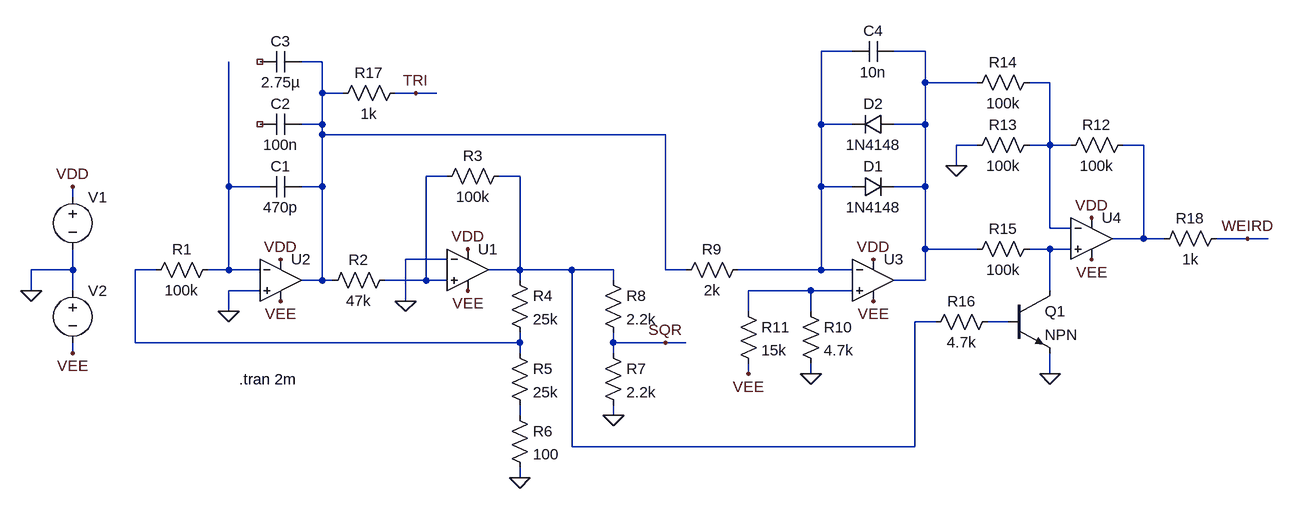
[diagram p0: schematic LFO.asc]
LFO.asc, the LTspice schematic file:
Version 4
SHEET 1 2760 680
WIRE 1984 -1488 1936 -1488
WIRE 2096 -1488 2048 -1488
WIRE 1168 -1472 1136 -1472
WIRE 2096 -1440 2096 -1488
WIRE 2176 -1440 2096 -1440
WIRE 2288 -1440 2256 -1440
WIRE 1168 -1424 1168 -1472
WIRE 1200 -1424 1168 -1424
WIRE 1312 -1424 1280 -1424
WIRE 1344 -1424 1312 -1424
WIRE 1168 -1376 1168 -1424
WIRE 1168 -1376 1136 -1376
WIRE 1936 -1376 1936 -1488
WIRE 1984 -1376 1936 -1376
WIRE 2096 -1376 2096 -1440
WIRE 2096 -1376 2048 -1376
WIRE 1168 -1360 1168 -1376
WIRE 1696 -1360 1168 -1360
WIRE 2176 -1344 2144 -1344
WIRE 2288 -1344 2288 -1440
WIRE 2288 -1344 2256 -1344
WIRE 2320 -1344 2288 -1344
WIRE 2432 -1344 2400 -1344
WIRE 2144 -1312 2144 -1344
WIRE 1360 -1296 1328 -1296
WIRE 1472 -1296 1440 -1296
WIRE 1024 -1280 1024 -1472
WIRE 1072 -1280 1024 -1280
WIRE 1168 -1280 1168 -1360
WIRE 1168 -1280 1136 -1280
WIRE 1936 -1280 1936 -1376
WIRE 1984 -1280 1936 -1280
WIRE 2096 -1280 2096 -1376
WIRE 2096 -1280 2048 -1280
WIRE 784 -1264 784 -1280
WIRE 2288 -1216 2288 -1344
WIRE 2320 -1216 2288 -1216
WIRE 2432 -1200 2432 -1344
WIRE 2432 -1200 2384 -1200
WIRE 2464 -1200 2432 -1200
WIRE 2592 -1200 2544 -1200
WIRE 2624 -1200 2592 -1200
WIRE 2096 -1184 2096 -1280
WIRE 2176 -1184 2096 -1184
WIRE 2288 -1184 2256 -1184
WIRE 2320 -1184 2288 -1184
WIRE 1360 -1168 1296 -1168
WIRE 784 -1152 784 -1184
WIRE 784 -1152 720 -1152
WIRE 912 -1152 880 -1152
WIRE 1024 -1152 1024 -1280
WIRE 1024 -1152 992 -1152
WIRE 1072 -1152 1024 -1152
WIRE 1472 -1152 1472 -1296
WIRE 1472 -1152 1424 -1152
WIRE 1552 -1152 1472 -1152
WIRE 1616 -1152 1552 -1152
WIRE 1696 -1152 1696 -1360
WIRE 1728 -1152 1696 -1152
WIRE 1936 -1152 1936 -1280
WIRE 1936 -1152 1808 -1152
WIRE 1984 -1152 1936 -1152
WIRE 1168 -1136 1168 -1280
WIRE 1168 -1136 1136 -1136
WIRE 1184 -1136 1168 -1136
WIRE 1328 -1136 1328 -1296
WIRE 1328 -1136 1264 -1136
WIRE 1360 -1136 1328 -1136
WIRE 1472 -1136 1472 -1152
WIRE 1616 -1136 1616 -1152
WIRE 2096 -1136 2096 -1184
WIRE 2096 -1136 2048 -1136
WIRE 720 -1120 720 -1152
WIRE 784 -1120 784 -1152
WIRE 1072 -1120 1024 -1120
WIRE 1920 -1120 1824 -1120
WIRE 1984 -1120 1920 -1120
WIRE 2288 -1120 2288 -1184
WIRE 1296 -1104 1296 -1168
WIRE 1024 -1088 1024 -1120
WIRE 1824 -1088 1824 -1120
WIRE 1920 -1088 1920 -1120
WIRE 2112 -1072 2080 -1072
WIRE 2224 -1072 2192 -1072
WIRE 880 -1040 880 -1152
WIRE 1472 -1040 1472 -1056
WIRE 1472 -1040 880 -1040
WIRE 1616 -1040 1616 -1056
WIRE 1696 -1040 1616 -1040
WIRE 1728 -1040 1696 -1040
WIRE 784 -1024 784 -1040
WIRE 1472 -1024 1472 -1040
WIRE 1616 -1024 1616 -1040
WIRE 1824 -992 1824 -1008
WIRE 1920 -992 1920 -1008
WIRE 2288 -992 2288 -1024
WIRE 1472 -928 1472 -944
WIRE 1616 -928 1616 -944
WIRE 1552 -880 1552 -1152
WIRE 2080 -880 2080 -1072
WIRE 2080 -880 1552 -880
WIRE 1472 -832 1472 -848
FLAG 720 -1120 0
FLAG 1104 -1168 VDD
FLAG 1104 -1104 VEE
FLAG 784 -1280 VDD
FLAG 784 -1024 VEE
FLAG 1024 -1088 0
FLAG 1392 -1184 VDD
FLAG 1392 -1120 VEE
FLAG 1296 -1104 0
FLAG 1472 -832 0
FLAG 1616 -928 0
FLAG 1696 -1040 SQR
FLAG 1312 -1424 TRI
FLAG 2016 -1168 VDD
FLAG 2016 -1104 VEE
FLAG 1920 -992 0
FLAG 1824 -992 VEE
FLAG 2352 -1232 VDD
FLAG 2352 -1168 VEE
FLAG 2144 -1312 0
FLAG 2288 -992 0
FLAG 2592 -1200 WEIRD
SYMBOL voltage 784 -1280 R0
WINDOW 3 24 96 Invisible 2
WINDOW 123 0 0 Left 2
WINDOW 39 0 0 Left 2
SYMATTR Value PWL(0 0 1m 12)
SYMATTR InstName V1
SYMBOL Opamps\\UniversalOpamp2 1392 -1152 R0
SYMATTR InstName U1
SYMATTR Value2 Avol=1Meg GBW=10Meg Slew=10Meg Vos=1u
SYMBOL Opamps\\UniversalOpamp2 1104 -1136 R0
SYMATTR InstName U2
SYMBOL cap 1136 -1296 R90
WINDOW 0 0 32 VBottom 2
WINDOW 3 32 32 VTop 2
SYMATTR InstName C1
SYMATTR Value 470p
SYMBOL cap 1136 -1392 R90
WINDOW 0 0 32 VBottom 2
WINDOW 3 32 32 VTop 2
SYMATTR InstName C2
SYMATTR Value 100n
SYMBOL cap 1136 -1488 R90
WINDOW 0 0 32 VBottom 2
WINDOW 3 32 32 VTop 2
SYMATTR InstName C3
SYMATTR Value 2.75µ
SYMBOL voltage 784 -1136 R0
WINDOW 3 24 96 Invisible 2
WINDOW 123 0 0 Left 2
WINDOW 39 0 0 Left 2
SYMATTR Value PWL(0 0 1m 12)
SYMATTR InstName V2
SYMBOL res 1008 -1168 R90
WINDOW 0 0 56 VBottom 2
WINDOW 3 32 56 VTop 2
SYMATTR InstName R1
SYMATTR Value 100k
SYMBOL res 1280 -1152 R90
WINDOW 0 0 56 VBottom 2
WINDOW 3 32 56 VTop 2
SYMATTR InstName R2
SYMATTR Value 47k
SYMBOL res 1456 -1312 R90
WINDOW 0 0 56 VBottom 2
WINDOW 3 32 56 VTop 2
SYMATTR InstName R3
SYMATTR Value 100k
SYMBOL res 1456 -1152 R0
SYMATTR InstName R4
SYMATTR Value 25k
SYMBOL res 1456 -1040 R0
SYMATTR InstName R5
SYMATTR Value 25k
SYMBOL res 1456 -944 R0
SYMATTR InstName R6
SYMATTR Value 100
SYMBOL res 1600 -1040 R0
SYMATTR InstName R7
SYMATTR Value 2.2k
SYMBOL res 1600 -1152 R0
SYMATTR InstName R8
SYMATTR Value 2.2k
SYMBOL Opamps\\UniversalOpamp2 2016 -1136 R0
SYMATTR InstName U3
SYMATTR Value2 Avol=1Meg GBW=10Meg Slew=1Meg Vos=1u
SYMBOL res 1824 -1168 R90
WINDOW 0 0 56 VBottom 2
WINDOW 3 32 56 VTop 2
SYMATTR InstName R9
SYMATTR Value 2k
SYMBOL diode 1984 -1264 R270
WINDOW 0 32 32 VTop 2
WINDOW 3 0 32 VBottom 2
SYMATTR InstName D1
SYMATTR Value 1N4148
SYMBOL diode 2048 -1360 M270
WINDOW 0 32 32 VTop 2
WINDOW 3 0 32 VBottom 2
SYMATTR InstName D2
SYMATTR Value 1N4148
SYMBOL res 1904 -1104 R0
SYMATTR InstName R10
SYMATTR Value 4.7k
SYMBOL res 1808 -1104 R0
SYMATTR InstName R11
SYMATTR Value 15k
SYMBOL cap 2048 -1504 R90
WINDOW 0 0 32 VBottom 2
WINDOW 3 32 32 VTop 2
SYMATTR InstName C4
SYMATTR Value 10n
SYMBOL Opamps\\UniversalOpamp2 2352 -1200 R0
SYMATTR InstName U4
SYMATTR Value2 Avol=1Meg GBW=10Meg Slew=1Meg Vos=1u
SYMBOL res 2416 -1360 R90
WINDOW 0 0 56 VBottom 2
WINDOW 3 32 56 VTop 2
SYMATTR InstName R12
SYMATTR Value 100k
SYMBOL res 2272 -1360 R90
WINDOW 0 0 56 VBottom 2
WINDOW 3 32 56 VTop 2
SYMATTR InstName R13
SYMATTR Value 100k
SYMBOL res 2272 -1456 R90
WINDOW 0 0 56 VBottom 2
WINDOW 3 32 56 VTop 2
SYMATTR InstName R14
SYMATTR Value 100k
SYMBOL res 2272 -1200 R90
WINDOW 0 0 56 VBottom 2
WINDOW 3 32 56 VTop 2
SYMATTR InstName R15
SYMATTR Value 100k
SYMBOL npn 2224 -1120 R0
SYMATTR InstName Q1
SYMBOL res 2208 -1088 R90
WINDOW 0 0 56 VBottom 2
WINDOW 3 32 56 VTop 2
SYMATTR InstName R16
SYMATTR Value 4.7k
SYMBOL res 1296 -1440 R90
WINDOW 0 0 56 VBottom 2
WINDOW 3 32 56 VTop 2
SYMATTR InstName R17
SYMATTR Value 1k
SYMBOL res 2560 -1216 R90
WINDOW 0 0 56 VBottom 2
WINDOW 3 32 56 VTop 2
SYMATTR InstName R18
SYMATTR Value 1k
TEXT 1040 -984 Left 2 !.tran 2m

The netlist it stands for:
* LFO.asc
V1 VDD 0 PWL(0 0 1m 12)
XU1 N006 0 VDD VEE N007 level.2 Avol=1Meg GBW=10Meg Slew=10Meg Vos=1u ilimit=25m rail=0 Vos=0 phimargin=45 en=0 enk=0 in=0 ink=0 Rin=500Meg  ; pins IN+ IN- V+ V- OUT
XU2 0 N008 VDD VEE N003 level.2 Avol=1Meg GBW=10Meg Slew=10Meg ilimit=25m rail=0 Vos=0 phimargin=45 en=0 enk=0 in=0 ink=0 Rin=500Meg  ; pins IN+ IN- V+ V- OUT
C1 N003 N008 470p
C2 N003 NC_01 100n
C3 N003 NC_02 2.75µ
V2 0 VEE PWL(0 0 1m 12)
R1 N008 N010 100k
R2 N006 N003 47k
R3 N007 N006 100k
R4 N007 N010 25k
R5 N010 N013 25k
R6 N013 0 100
R7 SQR 0 2.2k
R8 N007 SQR 2.2k
XU3 N011 N001 VDD VEE N002 level.2 Avol=1Meg GBW=10Meg Slew=1Meg Vos=1u ilimit=25m rail=0 Vos=0 phimargin=45 en=0 enk=0 in=0 ink=0 Rin=500Meg  ; pins IN+ IN- V+ V- OUT
R9 N001 N003 2k
D1 N001 N002 1N4148
D2 N002 N001 1N4148
R10 N011 0 4.7k
R11 N011 VEE 15k
C4 N002 N001 10n
XU4 N009 N004 VDD VEE N005 level.2 Avol=1Meg GBW=10Meg Slew=1Meg Vos=1u ilimit=25m rail=0 Vos=0 phimargin=45 en=0 enk=0 in=0 ink=0 Rin=500Meg  ; pins IN+ IN- V+ V- OUT
R12 N005 N004 100k
R13 N004 0 100k
R14 N004 N002 100k
R15 N009 N002 100k
Q1 N009 N012 0 0 NPN
R16 N012 N007 4.7k
R17 TRI N003 1k
R18 WEIRD N005 1k
.model D D
.lib standard.dio
.model NPN NPN
.model PNP PNP
.lib standard.bjt
.tran 2m
.lib UniversalOpamps2.sub
.backanno
.end